# EAGLE design power_cv_distro (EAGLE 7.2.0)
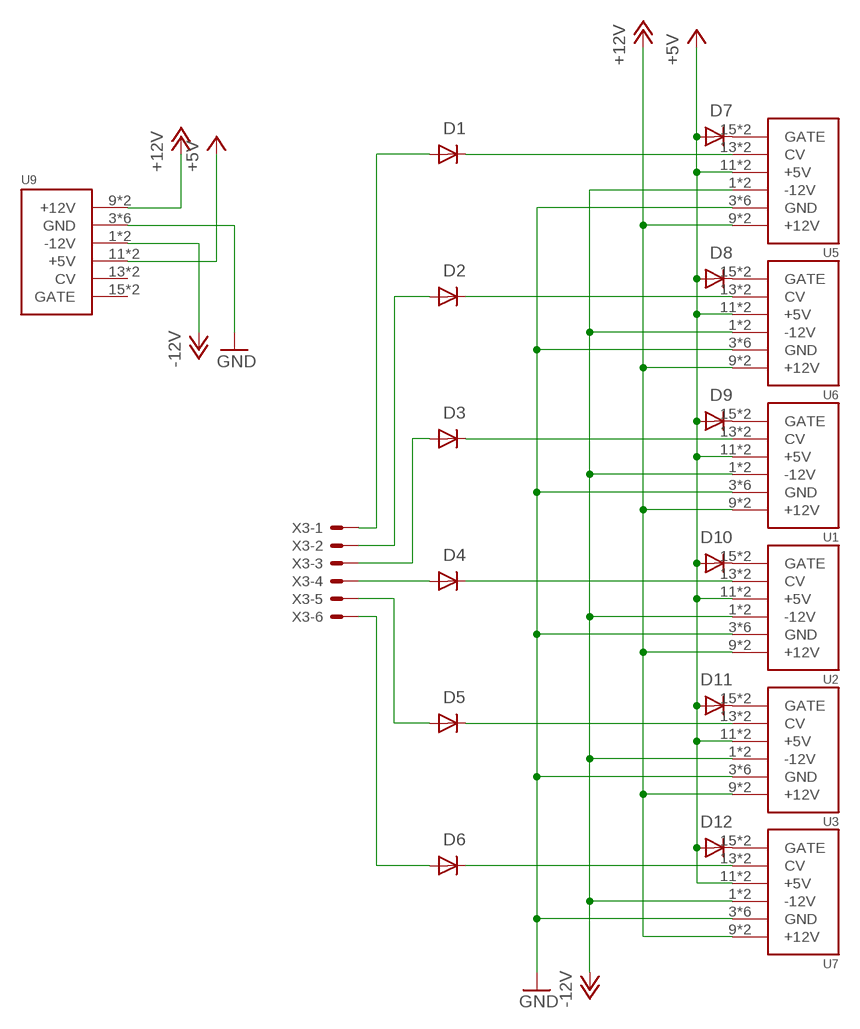
[diagram p0: schematic, sheet 1]

## Parts
D1  1N4148DO35-7  [DO35-7]
D2  1N4148DO35-7  [DO35-7]
D3  1N4148DO35-7  [DO35-7]
D4  1N4148DO35-7  [DO35-7]
D5  1N4148DO35-7  [DO35-7]
D6  1N4148DO35-7  [DO35-7]
D7  1N4148DO35-7  [DO35-7]
D8  1N4148DO35-7  [DO35-7]
D9  1N4148DO35-7  [DO35-7]
D10  1N4148DO35-7  [DO35-7]
D11  1N4148DO35-7  [DO35-7]
D12  1N4148DO35-7  [DO35-7]
U1  POWER  [POWER_16]
U2  POWER  [POWER_16]
U3  POWER  [POWER_16]
U5  POWER  [POWER_16]
U6  POWER  [POWER_16]
U7  POWER  [POWER_16]
U9  POWER  [POWER_16]
X3  22-23-2061  [22-23-2061]

## Nets
+5V: D7.A D8.A D9.A D10.A D11.A D12.A U1.11(+5V) U1.12(+5V) U2.11(+5V) U2.12(+5V) U3.11(+5V) U3.12(+5V) U5.11(+5V) U5.12(+5V) U6.11(+5V) U6.12(+5V) U7.11(+5V) U7.12(+5V) U9.11(+5V) U9.12(+5V)
+12V: U1.9(+12V) U1.10(+12V) U2.9(+12V) U2.10(+12V) U3.9(+12V) U3.10(+12V) U5.9(+12V) U5.10(+12V) U6.9(+12V) U6.10(+12V) U7.9(+12V) U7.10(+12V) U9.9(+12V) U9.10(+12V)
-12V: U1.1(-12V) U1.2(-12V) U2.1(-12V) U2.2(-12V) U3.1(-12V) U3.2(-12V) U5.1(-12V) U5.2(-12V) U6.1(-12V) U6.2(-12V) U7.1(-12V) U7.2(-12V) U9.1(-12V) U9.2(-12V)
GND: U1.3(GND) U1.4(GND) U1.5(GND) U1.6(GND) U1.7(GND) U1.8(GND) U2.3(GND) U2.4(GND) U2.5(GND) U2.6(GND) U2.7(GND) U2.8(GND) U3.3(GND) U3.4(GND) U3.5(GND) U3.6(GND) U3.7(GND) U3.8(GND) U5.3(GND) U5.4(GND) U5.5(GND) U5.6(GND) U5.7(GND) U5.8(GND) U6.3(GND) U6.4(GND) U6.5(GND) U6.6(GND) U6.7(GND) U6.8(GND) U7.3(GND) U7.4(GND) U7.5(GND) U7.6(GND) U7.7(GND) U7.8(GND) U9.3(GND) U9.4(GND) U9.5(GND) U9.6(GND) U9.7(GND) U9.8(GND)
N$1: D1.A X3.1
N$2: D2.A X3.2
N$3: D3.A X3.3
N$4: D4.A X3.4
N$5: D5.A X3.5
N$6: D6.A X3.6
N$7: D1.C U5.13(CV) U5.14(CV)
N$8: D2.C U6.13(CV) U6.14(CV)
N$9: D3.C U1.13(CV) U1.14(CV)
N$10: D4.C U2.13(CV) U2.14(CV)
N$11: D5.C U3.13(CV) U3.14(CV)
N$12: D6.C U7.13(CV) U7.14(CV)
N$13: D7.C U5.15(GATE) U5.16(GATE)
N$14: D8.C U6.15(GATE) U6.16(GATE)
N$15: D9.C U1.15(GATE) U1.16(GATE)
N$16: D10.C U2.15(GATE) U2.16(GATE)
N$17: D11.C U3.15(GATE) U3.16(GATE)
N$18: D12.C U7.15(GATE) U7.16(GATE)
Unconnected: U9.13(CV) U9.14(CV) U9.15(GATE) U9.16(GATE)

## Library data of the parts
D1-D12 = TR808clone:1N4148: DIODE high speed (Philips)
U1-U3 U5-U7 U9 = eurorack:POWER
X3 = con-molex:22-23-2061: .100" (2.54mm) Center Header - 6 Pin; MF: MOLEX; MPN: 22-23-2061; OC_FARNELL: 1462922; OC_NEWARK: 27C1933

## Net classes
0 default: width 0.635 mm, drill 0.254 mm, clearance 0.254 mm

## Board
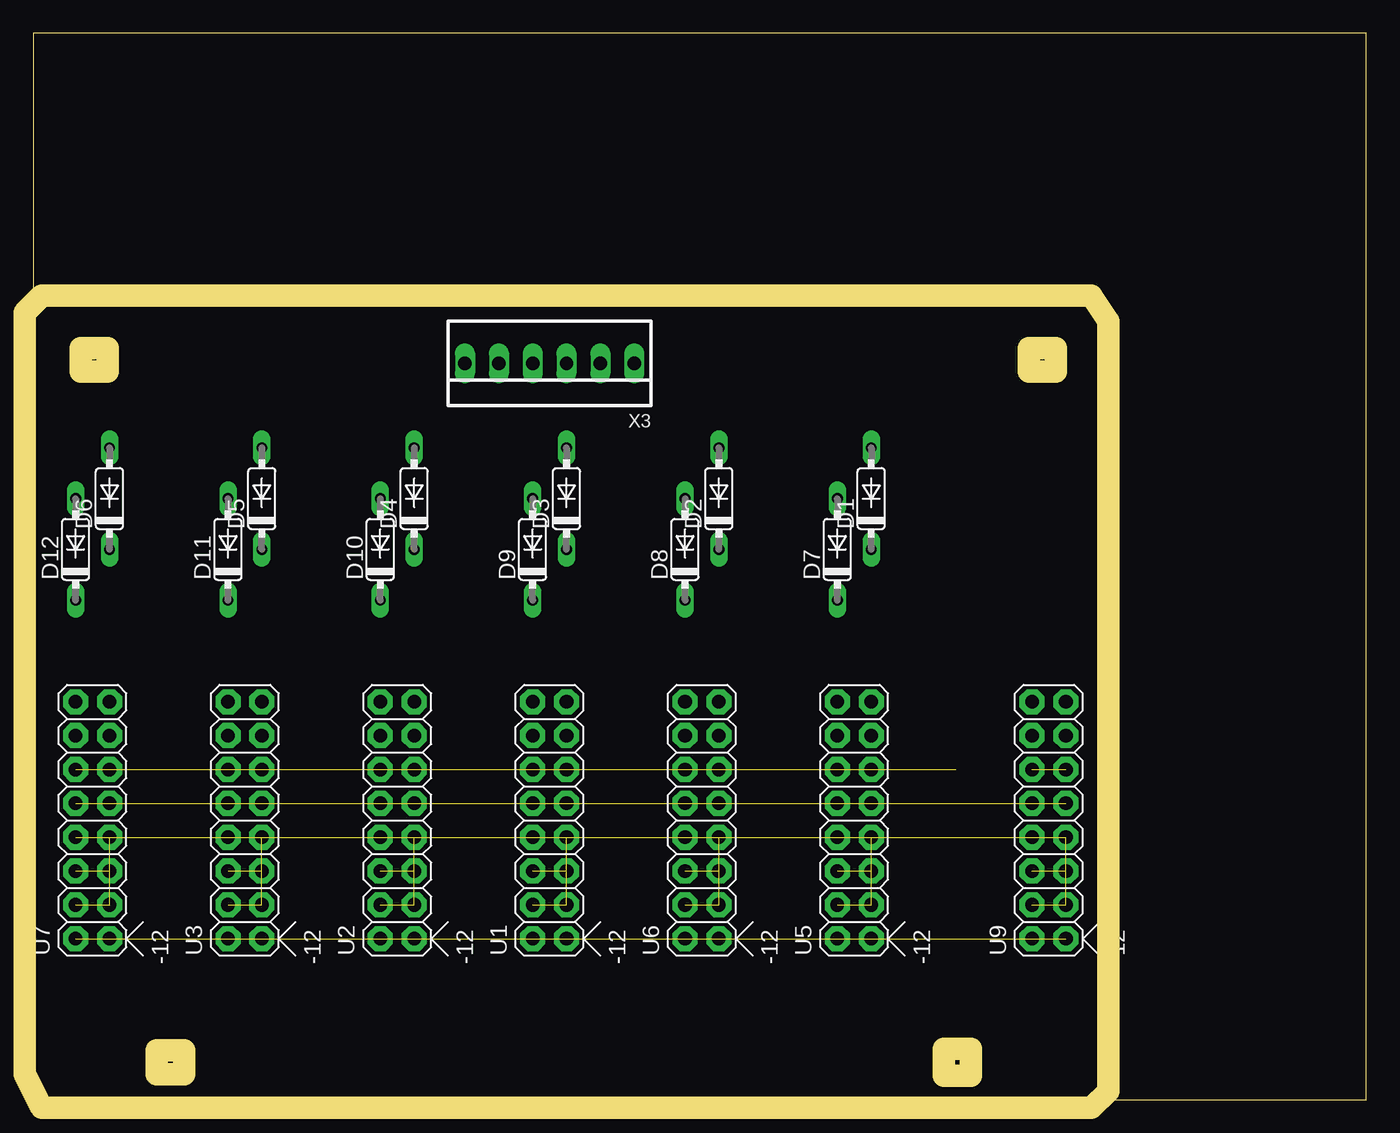
[diagram p1: board, top side]
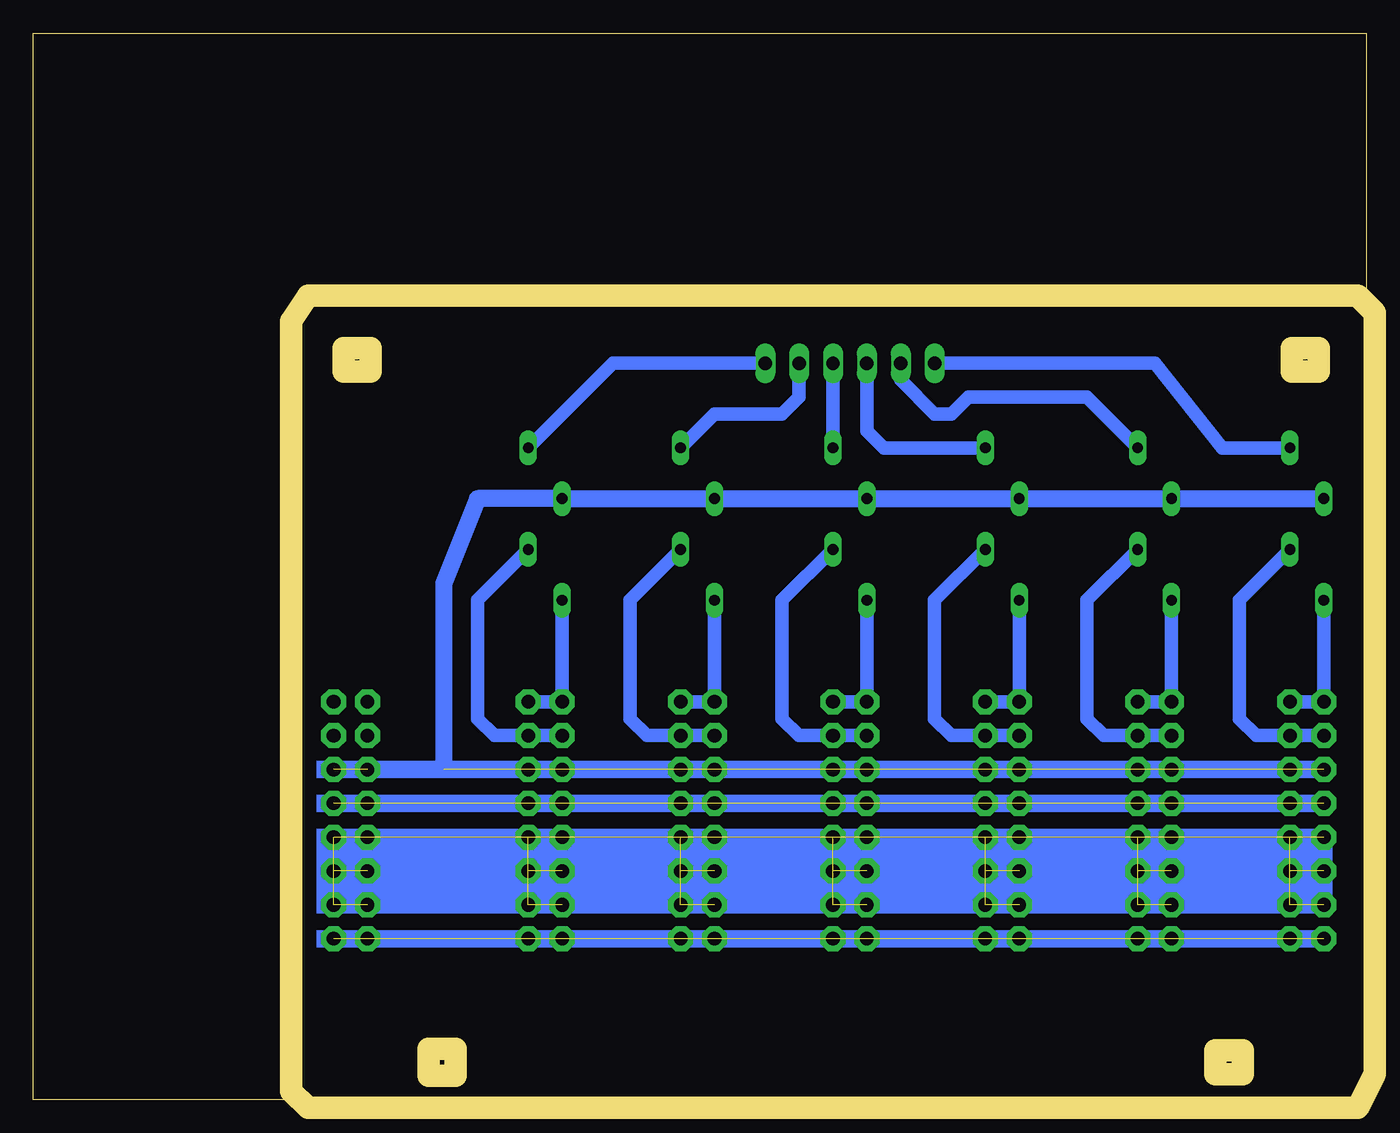
[diagram p2: board, bottom side, seen from below]

Size 100 x 80 mm. Coordinates in mm from the lower left corner, seen from the top.
Outline: 0,0 100,0 100,80 0,80 0,0
Copper layers (1*16): Top 0.035mm / dielectric 1.5mm / Bottom 0.035mm
Design rules "default *": minimum track width 26mil, minimum drill 31mil, track to track 16mil, track to pad 16mil, pad to pad 16mil, via to via 16mil, smd to smd 8mil, copper to edge 0mil, drill to drill 16mil, minimum pad ring 10mil, minimum via ring 8mil, stop-mask expansion 4mil, vias tented up to drill 0mil, thermal gap 10mil
Milling: 24 lines

### Footprints (pad centres in the part's own frame; a part is rotated, then mirrored left to right if it is on the bottom)
DO35-7 = drill 0.813 long: A 3.81,0; C -3.81,0
POWER_16 = drill 1.016 pad 1.88 octagon: 1 -6.35,-1.27; 2 -6.35,1.27; 3 -3.81,-1.27; 4 -3.81,1.27; 5 -1.27,-1.27; 6 -1.27,1.27; 7 1.27,-1.27; 8 1.27,1.27; 9 3.81,-1.27; 10 3.81,1.27; 11 6.35,-1.27; 12 6.35,1.27; 13 8.89,-1.27; 14 8.89,1.27; 15 11.43,-1.27; 16 11.43,1.27
22-23-2061 = drill 1 long: 1 -6.35,0; 2 -3.81,0; 3 -1.27,0; 4 1.27,0; 5 3.81,0; 6 6.35,0

### Placement (x,y rotation side)
D1  62.87,45.09 90 top
D2  51.44,45.09 90 top
D3  40.01,45.09 90 top
D4  28.57,45.09 90 top
D5  17.14,45.09 90 top
D6  5.71,45.09 90 top
D7  60.33,41.27 90 top
D8  48.9,41.27 90 top
D9  37.47,41.27 90 top
D10  26.04,41.27 90 top
D11  14.61,41.27 90 top
D12  3.17,41.27 90 top
U1  38.73,18.41 90 top
U2  27.3,18.41 90 top
U3  15.88,18.41 90 top
U5  61.59,18.41 90 top
U6  50.16,18.41 90 top
U7  4.45,18.41 90 top
U9  76.2,18.41 90 top
X3  38.73,55.24 180 top

### Tracks (layer width: path | path; a pad name or v marks a point on that pad's centre or on a via)
+5V  (13 unrouted)
  Bottom 1.016: 69.22,24.77 U9.12
  Bottom 1.27: 69.22,24.77 69.22,38.73 66.67,45.09 D7.A D8.A D9.A D10.A D11.A D12.A
+12V  (13 unrouted)
-12V  (13 unrouted)
GND  (41 unrouted)
N$1
  Bottom 1.016: X3.1 56.52,55.24 D1.A
N$2
  Bottom 1.016: X3.2 42.55,52.7 43.81,51.44 48.9,51.44 D2.A
N$3
  Bottom 1.016: X3.3 D3.A
N$4
  Bottom 1.016: D4.A 36.2,48.9 37.47,50.16 X3.4
N$5
  Bottom 1.016: X3.5 34.92,53.98 32.38,51.44 31.11,51.44 29.84,52.7 20.95,52.7 D5.A
N$6
  Bottom 1.016: X3.6 15.88,55.24 10.79,48.9 D6.A
N$7
  Bottom 1.016: D1.C 66.67,37.47 66.67,28.57 65.41,27.3 U5.13 U5.14
N$8
  Bottom 1.016: U6.14 U6.13 53.98,27.3 55.24,28.57 55.24,37.47 D2.C
N$9
  Bottom 1.016: D3.C 43.81,37.47 43.81,28.57 42.55,27.3 U1.13 U1.14
N$10
  Bottom 1.016: U2.14 U2.13 31.11,27.3 32.38,28.57 32.38,37.47 D4.C
N$11
  Bottom 1.016: D5.C 20.95,37.47 20.95,28.57 19.68,27.3 U3.13 U3.14
N$12
  Bottom 1.016: U7.14 U7.13 8.26,27.3 9.53,28.57 9.53,37.47 D6.C
N$13
  Bottom 1.016: D7.C U5.16 U5.15
N$14
  Bottom 1.016: D8.C U6.16 U6.15
N$15
  Bottom 1.016: D9.C U1.16 U1.15
N$16
  Bottom 1.016: D10.C U2.16 U2.15
N$17
  Bottom 1.016: U3.15 U3.16 D11.C
N$18
  Bottom 1.016: D12.C U7.16 U7.15
(copper drawn outside any net)
  shapes: Bottom area x4